# EAGLE design MxxxSMT (EAGLE 6.6.0)

## Sheet 1 of 8
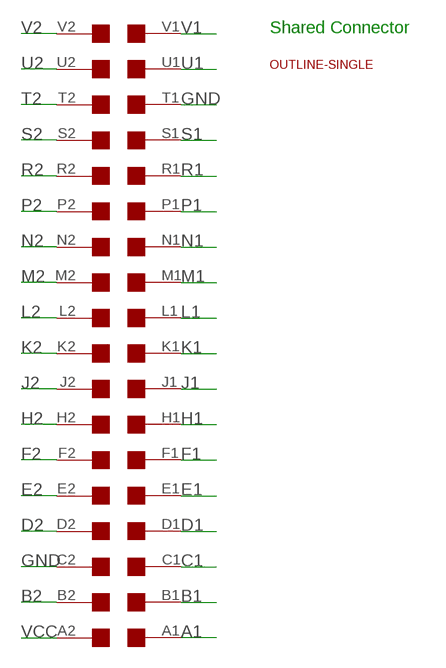
[diagram p0: schematic, sheet 1]

### Parts
U$1  EDGE-2CONNECTOR  [EDGE-CON2]
U$4  OUTLINE-SINGLE  [SINGLE]

### Nets
A1: U$1.A1 ; also sheet 2,3,4,5,6,7,8
B1: U$1.B1 ; also sheet 2,3,4,5,6,7,8
B2: U$1.B2
C1: U$1.C1 ; also sheet 2,3,4,5,6,7,8
D1: U$1.D1 ; also sheet 2,3,4,5,6,7,8
D2: U$1.D2 ; also sheet 2,3,4,5,6,7,8
E1: U$1.E1 ; also sheet 2,3,4,5,7,8
E2: U$1.E2 ; also sheet 2,3,4,5,6,7,8
F1: U$1.F1 ; also sheet 2,3,4,5,6,7,8
F2: U$1.F2 ; also sheet 2,3,4,5,6,7,8
GND [Power]: U$1.C2 U$1.T1 ; also sheet 2,3,4,5,6,7,8
H1: U$1.H1 ; also sheet 2,3,4,5,6,7,8
H2: U$1.H2 ; also sheet 2,3,4,5,6,7,8
J1: U$1.J1 ; also sheet 2,3,4,5,6,7,8
J2: U$1.J2 ; also sheet 2,3,4,5,6,7,8
K1: U$1.K1 ; also sheet 2,3,4,5,6,7,8
K2: U$1.K2 ; also sheet 2,3,4,5,6,7,8
L1: U$1.L1 ; also sheet 2,3,4,5,7,8
L2: U$1.L2 ; also sheet 2,3,4,5,6,7,8
M1: U$1.M1 ; also sheet 2,3,4,5,6,7,8
M2: U$1.M2 ; also sheet 2,3,4,5,6,7,8
N1: U$1.N1 ; also sheet 2,3,4,5,6,7,8
N2: U$1.N2 ; also sheet 2,3,4,5,6,7,8
P1: U$1.P1 ; also sheet 2,3,4,5,6,7,8
P2: U$1.P2 ; also sheet 2,3,4,5,6,7,8
R1: U$1.R1 ; also sheet 2,3,4,5,6,7,8
R2: U$1.R2 ; also sheet 2,3,4,5,6,7,8
S1: U$1.S1 ; also sheet 2,3,4,5,7,8
S2: U$1.S2 ; also sheet 2,3,4,5,6,7,8
T2: U$1.T2 ; also sheet 2,3,4,5,6,7,8
U1: U$1.U1 ; also sheet 2,3,4,7,8
U2: U$1.U2 ; also sheet 2,3,4,5,6,7,8
V1: U$1.V1 ; also sheet 2,3,4,7,8
V2: U$1.V2 ; also sheet 2,3,4,5,6,7,8
VCC [Power]: U$1.A2 ; also sheet 2,3,4,5,6,7,8

### Notes on the sheet
- Shared Connector

## Sheet 2 of 8
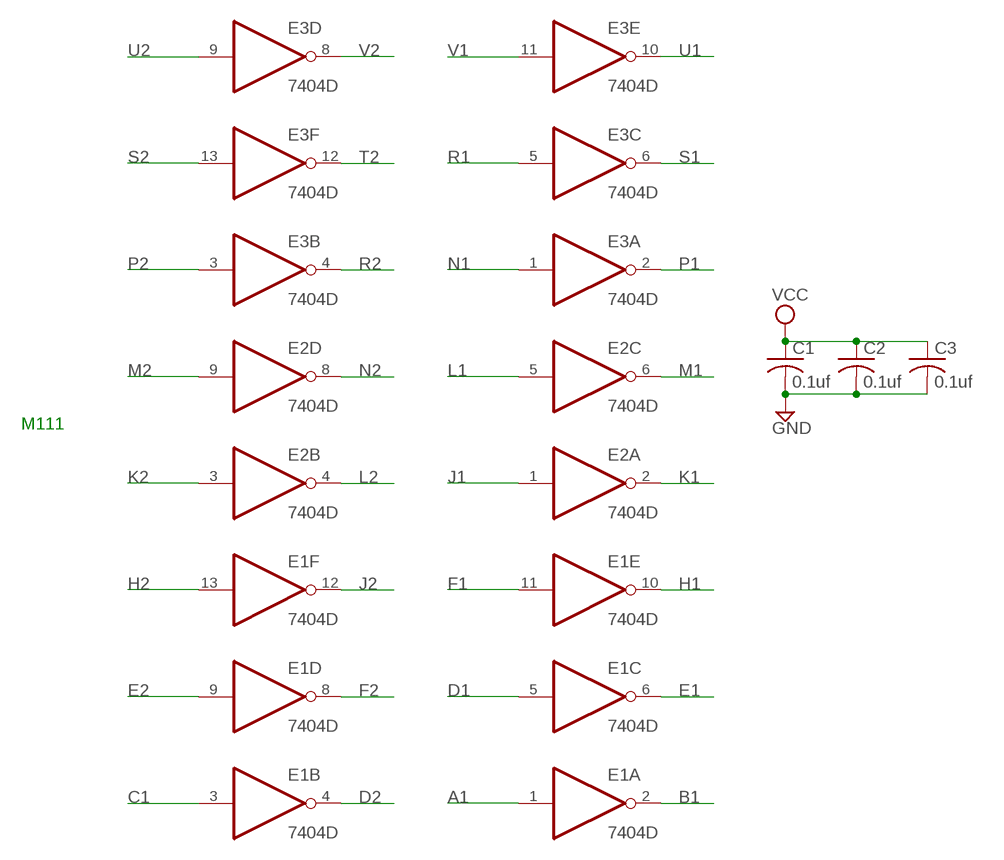
[diagram p1: schematic, sheet 2]

### Parts
C1  0.1uf  C-US050-025X075  [C050-025X075]
C2  0.1uf  C-US050-025X075  [C050-025X075]
C3  0.1uf  C-US050-025X075  [C050-025X075]
E1  7404D  [SO14]
E2  7404D  [SO14]
E3  7404D  [SO14]

### Nets
A1: E1.1(A:I) ; also sheet 1,3,4,5,6,7,8
B1: E1.2(A:O) ; also sheet 1,3,4,5,6,7,8
C1: E1.3(B:I) ; also sheet 1,3,4,5,6,7,8
D1: E1.5(C:I) ; also sheet 1,3,4,5,6,7,8
D2: E1.4(B:O) ; also sheet 1,3,4,5,6,7,8
E1: E1.6(C:O) ; also sheet 1,3,4,5,7,8
E2: E1.9(D:I) ; also sheet 1,3,4,5,6,7,8
F1: E1.11(E:I) ; also sheet 1,3,4,5,6,7,8
F2: E1.8(D:O) ; also sheet 1,3,4,5,6,7,8
GND [Power]: C1.2 C2.2 C3.2 ; also sheet 1,3,4,5,6,7,8
H1: E1.10(E:O) ; also sheet 1,3,4,5,6,7,8
H2: E1.13(F:I) ; also sheet 1,3,4,5,6,7,8
J1: E2.1(A:I) ; also sheet 1,3,4,5,6,7,8
J2: E1.12(F:O) ; also sheet 1,3,4,5,6,7,8
K1: E2.2(A:O) ; also sheet 1,3,4,5,6,7,8
K2: E2.3(B:I) ; also sheet 1,3,4,5,6,7,8
L1: E2.5(C:I) ; also sheet 1,3,4,5,7,8
L2: E2.4(B:O) ; also sheet 1,3,4,5,6,7,8
M1: E2.6(C:O) ; also sheet 1,3,4,5,6,7,8
M2: E2.9(D:I) ; also sheet 1,3,4,5,6,7,8
N1: E3.1(A:I) ; also sheet 1,3,4,5,6,7,8
N2: E2.8(D:O) ; also sheet 1,3,4,5,6,7,8
P1: E3.2(A:O) ; also sheet 1,3,4,5,6,7,8
P2: E3.3(B:I) ; also sheet 1,3,4,5,6,7,8
R1: E3.5(C:I) ; also sheet 1,3,4,5,6,7,8
R2: E3.4(B:O) ; also sheet 1,3,4,5,6,7,8
S1: E3.6(C:O) ; also sheet 1,3,4,5,7,8
S2: E3.13(F:I) ; also sheet 1,3,4,5,6,7,8
T2: E3.12(F:O) ; also sheet 1,3,4,5,6,7,8
U1: E3.10(E:O) ; also sheet 1,3,4,7,8
U2: E3.9(D:I) ; also sheet 1,3,4,5,6,7,8
V1: E3.11(E:I) ; also sheet 1,3,4,7,8
V2: E3.8(D:O) ; also sheet 1,3,4,5,6,7,8
VCC [Power]: C1.1 C2.1 C3.1 ; also sheet 1,3,4,5,6,7,8
Unconnected: E2.10(E:O) E2.11(E:I) E2.12(F:O) E2.13(F:I)

### Notes on the sheet
- M111

## Sheet 3 of 8
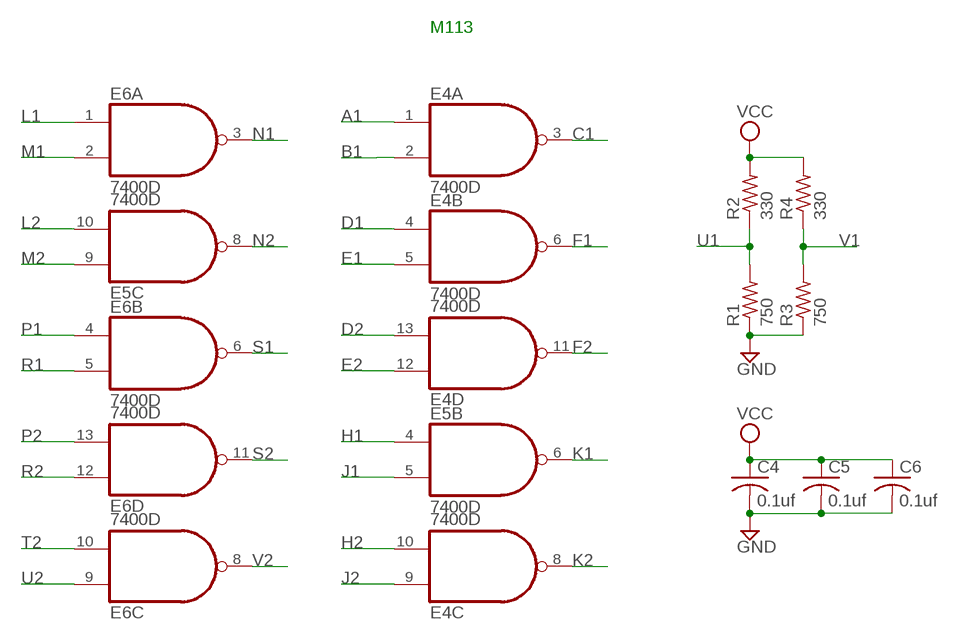
[diagram p2: schematic, sheet 3]

### Parts
C4  0.1uf  C-US050-025X075  [C050-025X075]
C5  0.1uf  C-US050-025X075  [C050-025X075]
C6  0.1uf  C-US050-025X075  [C050-025X075]
E4  7400D  [SO14]
E5  7400D  [SO14]
E6  7400D  [SO14]
R1  750  R-US_0207/10  [0207/10]
R2  330  R-US_0207/10  [0207/10]
R3  750  R-US_0207/10  [0207/10]
R4  330  R-US_0207/10  [0207/10]

### Nets
A1: E4.1(A:I0) ; also sheet 1,2,4,5,6,7,8
B1: E4.2(A:I1) ; also sheet 1,2,4,5,6,7,8
C1: E4.3(A:O) ; also sheet 1,2,4,5,6,7,8
D1: E4.4(B:I0) ; also sheet 1,2,4,5,6,7,8
D2: E4.13(D:I1) ; also sheet 1,2,4,5,6,7,8
E1: E4.5(B:I1) ; also sheet 1,2,4,5,7,8
E2: E4.12(D:I0) ; also sheet 1,2,4,5,6,7,8
F1: E4.6(B:O) ; also sheet 1,2,4,5,6,7,8
F2: E4.11(D:O) ; also sheet 1,2,4,5,6,7,8
GND [Power]: C4.2 C5.2 C6.2 R1.1 R3.1 ; also sheet 1,2,4,5,6,7,8
H1: E5.4(B:I0) ; also sheet 1,2,4,5,6,7,8
H2: E4.10(C:I1) ; also sheet 1,2,4,5,6,7,8
J1: E5.5(B:I1) ; also sheet 1,2,4,5,6,7,8
J2: E4.9(C:I0) ; also sheet 1,2,4,5,6,7,8
K1: E5.6(B:O) ; also sheet 1,2,4,5,6,7,8
K2: E4.8(C:O) ; also sheet 1,2,4,5,6,7,8
L1: E6.1(A:I0) ; also sheet 1,2,4,5,7,8
L2: E5.10(C:I1) ; also sheet 1,2,4,5,6,7,8
M1: E6.2(A:I1) ; also sheet 1,2,4,5,6,7,8
M2: E5.9(C:I0) ; also sheet 1,2,4,5,6,7,8
N1: E6.3(A:O) ; also sheet 1,2,4,5,6,7,8
N2: E5.8(C:O) ; also sheet 1,2,4,5,6,7,8
P1: E6.4(B:I0) ; also sheet 1,2,4,5,6,7,8
P2: E6.13(D:I1) ; also sheet 1,2,4,5,6,7,8
R1: E6.5(B:I1) ; also sheet 1,2,4,5,6,7,8
R2: E6.12(D:I0) ; also sheet 1,2,4,5,6,7,8
S1: E6.6(B:O) ; also sheet 1,2,4,5,7,8
S2: E6.11(D:O) ; also sheet 1,2,4,5,6,7,8
T2: E6.10(C:I1) ; also sheet 1,2,4,5,6,7,8
U1: R1.2 R2.1 ; also sheet 1,2,4,7,8
U2: E6.9(C:I0) ; also sheet 1,2,4,5,6,7,8
V1: R3.2 R4.1 ; also sheet 1,2,4,7,8
V2: E6.8(C:O) ; also sheet 1,2,4,5,6,7,8
VCC [Power]: C4.1 C5.1 C6.1 R2.2 R4.2 ; also sheet 1,2,4,5,6,7,8
Unconnected: E5.1(A:I0) E5.2(A:I1) E5.3(A:O) E5.11(D:O) E5.12(D:I0) E5.13(D:I1)

### Notes on the sheet
- M113

## Sheet 4 of 8
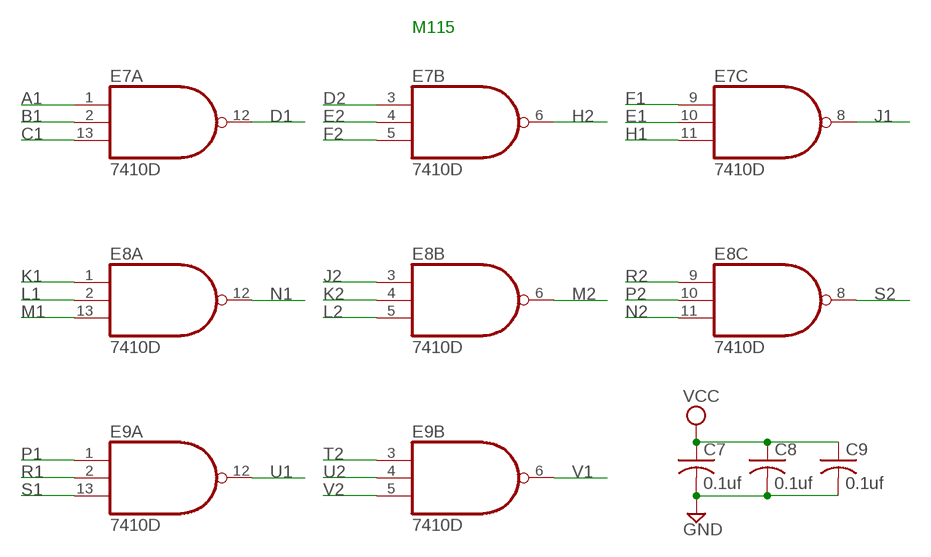
[diagram p3: schematic, sheet 4]

### Parts
C7  0.1uf  C-US050-025X075  [C050-025X075]
C8  0.1uf  C-US050-025X075  [C050-025X075]
C9  0.1uf  C-US050-025X075  [C050-025X075]
E7  7410D  [SO14]
E8  7410D  [SO14]
E9  7410D  [SO14]

### Nets
A1: E7.1(A:I0) ; also sheet 1,2,3,5,6,7,8
B1: E7.2(A:I1) ; also sheet 1,2,3,5,6,7,8
C1: E7.13(A:I2) ; also sheet 1,2,3,5,6,7,8
D1: E7.12(A:O) ; also sheet 1,2,3,5,6,7,8
D2: E7.3(B:I0) ; also sheet 1,2,3,5,6,7,8
E1: E7.10(C:I1) ; also sheet 1,2,3,5,7,8
E2: E7.4(B:I1) ; also sheet 1,2,3,5,6,7,8
F1: E7.9(C:I0) ; also sheet 1,2,3,5,6,7,8
F2: E7.5(B:I2) ; also sheet 1,2,3,5,6,7,8
GND [Power]: C7.2 C8.2 C9.2 ; also sheet 1,2,3,5,6,7,8
H1: E7.11(C:I2) ; also sheet 1,2,3,5,6,7,8
H2: E7.6(B:O) ; also sheet 1,2,3,5,6,7,8
J1: E7.8(C:O) ; also sheet 1,2,3,5,6,7,8
J2: E8.3(B:I0) ; also sheet 1,2,3,5,6,7,8
K1: E8.1(A:I0) ; also sheet 1,2,3,5,6,7,8
K2: E8.4(B:I1) ; also sheet 1,2,3,5,6,7,8
L1: E8.2(A:I1) ; also sheet 1,2,3,5,7,8
L2: E8.5(B:I2) ; also sheet 1,2,3,5,6,7,8
M1: E8.13(A:I2) ; also sheet 1,2,3,5,6,7,8
M2: E8.6(B:O) ; also sheet 1,2,3,5,6,7,8
N1: E8.12(A:O) ; also sheet 1,2,3,5,6,7,8
N2: E8.11(C:I2) ; also sheet 1,2,3,5,6,7,8
P1: E9.1(A:I0) ; also sheet 1,2,3,5,6,7,8
P2: E8.10(C:I1) ; also sheet 1,2,3,5,6,7,8
R1: E9.2(A:I1) ; also sheet 1,2,3,5,6,7,8
R2: E8.9(C:I0) ; also sheet 1,2,3,5,6,7,8
S1: E9.13(A:I2) ; also sheet 1,2,3,5,7,8
S2: E8.8(C:O) ; also sheet 1,2,3,5,6,7,8
T2: E9.3(B:I0) ; also sheet 1,2,3,5,6,7,8
U1: E9.12(A:O) ; also sheet 1,2,3,7,8
U2: E9.4(B:I1) ; also sheet 1,2,3,5,6,7,8
V1: E9.6(B:O) ; also sheet 1,2,3,7,8
V2: E9.5(B:I2) ; also sheet 1,2,3,5,6,7,8
VCC [Power]: C7.1 C8.1 C9.1 ; also sheet 1,2,3,5,6,7,8
Unconnected: E9.8(C:O) E9.9(C:I0) E9.10(C:I1) E9.11(C:I2)

### Notes on the sheet
- M115

## Sheet 5 of 8
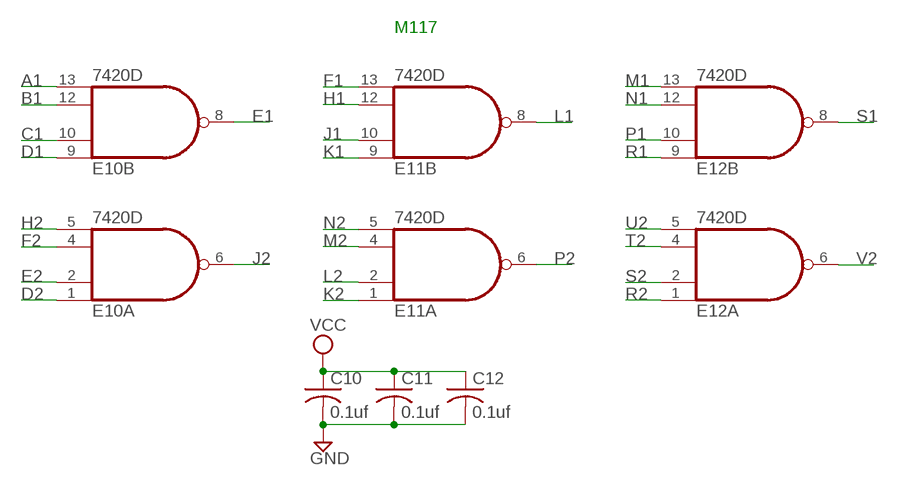
[diagram p4: schematic, sheet 5]

### Parts
C10  0.1uf  C-US050-025X075  [C050-025X075]
C11  0.1uf  C-US050-025X075  [C050-025X075]
C12  0.1uf  C-US050-025X075  [C050-025X075]
E10  7420D  74S20D  [SO14]
E11  7420D  74S20D  [SO14]
E12  7420D  74S20D  [SO14]

### Nets
A1: E10.13(B:I3) ; also sheet 1,2,3,4,6,7,8
B1: E10.12(B:I2) ; also sheet 1,2,3,4,6,7,8
C1: E10.10(B:I1) ; also sheet 1,2,3,4,6,7,8
D1: E10.9(B:I0) ; also sheet 1,2,3,4,6,7,8
D2: E10.1(A:I0) ; also sheet 1,2,3,4,6,7,8
E1: E10.8(B:O) ; also sheet 1,2,3,4,7,8
E2: E10.2(A:I1) ; also sheet 1,2,3,4,6,7,8
F1: E11.13(B:I3) ; also sheet 1,2,3,4,6,7,8
F2: E10.4(A:I2) ; also sheet 1,2,3,4,6,7,8
GND [Power]: C10.2 C11.2 C12.2 ; also sheet 1,2,3,4,6,7,8
H1: E11.12(B:I2) ; also sheet 1,2,3,4,6,7,8
H2: E10.5(A:I3) ; also sheet 1,2,3,4,6,7,8
J1: E11.10(B:I1) ; also sheet 1,2,3,4,6,7,8
J2: E10.6(A:O) ; also sheet 1,2,3,4,6,7,8
K1: E11.9(B:I0) ; also sheet 1,2,3,4,6,7,8
K2: E11.1(A:I0) ; also sheet 1,2,3,4,6,7,8
L1: E11.8(B:O) ; also sheet 1,2,3,4,7,8
L2: E11.2(A:I1) ; also sheet 1,2,3,4,6,7,8
M1: E12.13(B:I3) ; also sheet 1,2,3,4,6,7,8
M2: E11.4(A:I2) ; also sheet 1,2,3,4,6,7,8
N1: E12.12(B:I2) ; also sheet 1,2,3,4,6,7,8
N2: E11.5(A:I3) ; also sheet 1,2,3,4,6,7,8
P1: E12.10(B:I1) ; also sheet 1,2,3,4,6,7,8
P2: E11.6(A:O) ; also sheet 1,2,3,4,6,7,8
R1: E12.9(B:I0) ; also sheet 1,2,3,4,6,7,8
R2: E12.1(A:I0) ; also sheet 1,2,3,4,6,7,8
S1: E12.8(B:O) ; also sheet 1,2,3,4,7,8
S2: E12.2(A:I1) ; also sheet 1,2,3,4,6,7,8
T2: E12.4(A:I2) ; also sheet 1,2,3,4,6,7,8
U2: E12.5(A:I3) ; also sheet 1,2,3,4,6,7,8
V2: E12.6(A:O) ; also sheet 1,2,3,4,6,7,8
VCC [Power]: C10.1 C11.1 C12.1 ; also sheet 1,2,3,4,6,7,8

### Notes on the sheet
- M117

## Sheet 6 of 8
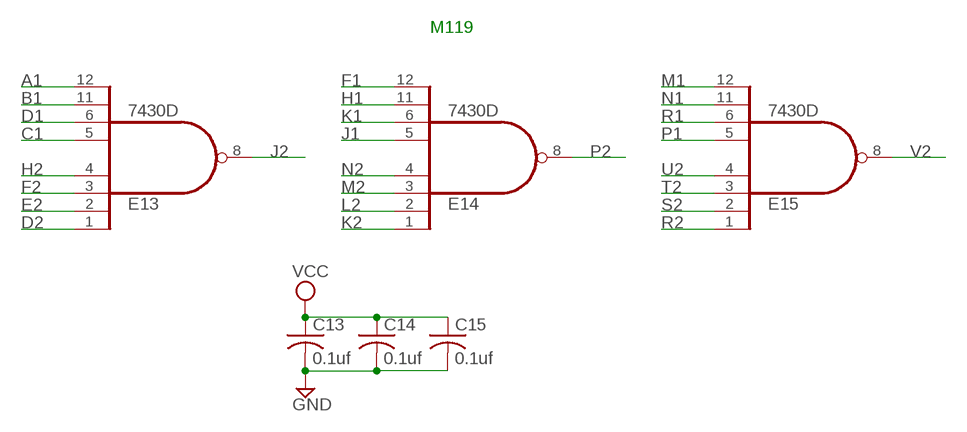
[diagram p5: schematic, sheet 6]

### Parts
C13  0.1uf  C-US050-025X075  [C050-025X075]
C14  0.1uf  C-US050-025X075  [C050-025X075]
C15  0.1uf  C-US050-025X075  [C050-025X075]
E13  7430D  [SO14]
E14  7430D  [SO14]
E15  7430D  [SO14]

### Nets
A1: E13.12(I7) ; also sheet 1,2,3,4,5,7,8
B1: E13.11(I6) ; also sheet 1,2,3,4,5,7,8
C1: E13.5(I4) ; also sheet 1,2,3,4,5,7,8
D1: E13.6(I5) ; also sheet 1,2,3,4,5,7,8
D2: E13.1(I0) ; also sheet 1,2,3,4,5,7,8
E2: E13.2(I1) ; also sheet 1,2,3,4,5,7,8
F1: E14.12(I7) ; also sheet 1,2,3,4,5,7,8
F2: E13.3(I2) ; also sheet 1,2,3,4,5,7,8
GND [Power]: C13.2 C14.2 C15.2 ; also sheet 1,2,3,4,5,7,8
H1: E14.11(I6) ; also sheet 1,2,3,4,5,7,8
H2: E13.4(I3) ; also sheet 1,2,3,4,5,7,8
J1: E14.5(I4) ; also sheet 1,2,3,4,5,7,8
J2: E13.8(O) ; also sheet 1,2,3,4,5,7,8
K1: E14.6(I5) ; also sheet 1,2,3,4,5,7,8
K2: E14.1(I0) ; also sheet 1,2,3,4,5,7,8
L2: E14.2(I1) ; also sheet 1,2,3,4,5,7,8
M1: E15.12(I7) ; also sheet 1,2,3,4,5,7,8
M2: E14.3(I2) ; also sheet 1,2,3,4,5,7,8
N1: E15.11(I6) ; also sheet 1,2,3,4,5,7,8
N2: E14.4(I3) ; also sheet 1,2,3,4,5,7,8
P1: E15.5(I4) ; also sheet 1,2,3,4,5,7,8
P2: E14.8(O) ; also sheet 1,2,3,4,5,7,8
R1: E15.6(I5) ; also sheet 1,2,3,4,5,7,8
R2: E15.1(I0) ; also sheet 1,2,3,4,5,7,8
S2: E15.2(I1) ; also sheet 1,2,3,4,5,7,8
T2: E15.3(I2) ; also sheet 1,2,3,4,5,7,8
U2: E15.4(I3) ; also sheet 1,2,3,4,5,7,8
V2: E15.8(O) ; also sheet 1,2,3,4,5,7,8
VCC [Power]: C13.1 C14.1 C15.1 ; also sheet 1,2,3,4,5,7,8

### Notes on the sheet
- M119

## Sheet 7 of 8
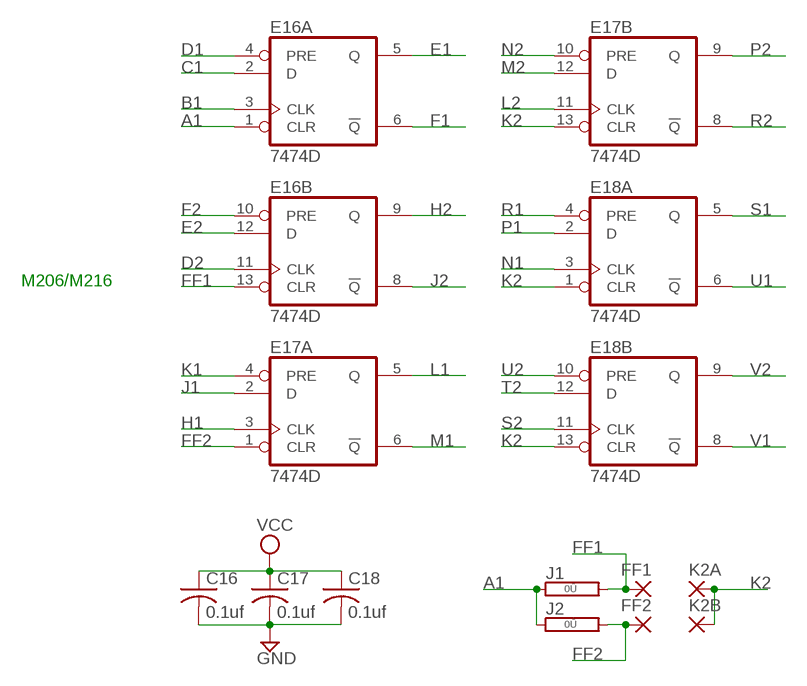
[diagram p6: schematic, sheet 7]

### Parts
C16  0.1uf  C-US050-025X075  [C050-025X075]
C17  0.1uf  C-US050-025X075  [C050-025X075]
C18  0.1uf  C-US050-025X075  [C050-025X075]
E16  7474D  74S74D  [SO14]
E17  7474D  74S74D  [SO14]
E18  7474D  74S74D  [SO14]
FF1  1,6/0,8  [1,6/0,8]
FF2  1,6/0,8  [1,6/0,8]
J1  0R  [0R/10]
J2  0R  [0R/10]
K2A  1,6/0,8  [1,6/0,8]
K2B  1,6/0,8  [1,6/0,8]

### Nets
A1: E16.1(A:CLR) J1.1 J2.1 ; also sheet 1,2,3,4,5,6,8
B1: E16.3(A:CLK) ; also sheet 1,2,3,4,5,6,8
C1: E16.2(A:D) ; also sheet 1,2,3,4,5,6,8
D1: E16.4(A:PRE) ; also sheet 1,2,3,4,5,6,8
D2: E16.11(B:CLK) ; also sheet 1,2,3,4,5,6,8
E1: E16.5(A:Q) ; also sheet 1,2,3,4,5,8
E2: E16.12(B:D) ; also sheet 1,2,3,4,5,6,8
F1: E16.6(A:!Q) ; also sheet 1,2,3,4,5,6,8
F2: E16.10(B:PRE) ; also sheet 1,2,3,4,5,6,8
FF1: E16.13(B:CLR) FF1.1(P) J1.2 ; also sheet 8
FF2: E17.1(A:CLR) FF2.1(P) J2.2 ; also sheet 8
GND [Power]: C16.2 C17.2 C18.2 ; also sheet 1,2,3,4,5,6,8
H1: E17.3(A:CLK) ; also sheet 1,2,3,4,5,6,8
H2: E16.9(B:Q) ; also sheet 1,2,3,4,5,6,8
J1: E17.2(A:D) ; also sheet 1,2,3,4,5,6,8
J2: E16.8(B:!Q) ; also sheet 1,2,3,4,5,6,8
K1: E17.4(A:PRE) ; also sheet 1,2,3,4,5,6,8
K2: E17.13(B:CLR) E18.1(A:CLR) E18.13(B:CLR) K2A.1(P) K2B.1(P) ; also sheet 1,2,3,4,5,6,8
L1: E17.5(A:Q) ; also sheet 1,2,3,4,5,8
L2: E17.11(B:CLK) ; also sheet 1,2,3,4,5,6,8
M1: E17.6(A:!Q) ; also sheet 1,2,3,4,5,6,8
M2: E17.12(B:D) ; also sheet 1,2,3,4,5,6,8
N1: E18.3(A:CLK) ; also sheet 1,2,3,4,5,6,8
N2: E17.10(B:PRE) ; also sheet 1,2,3,4,5,6,8
P1: E18.2(A:D) ; also sheet 1,2,3,4,5,6,8
P2: E17.9(B:Q) ; also sheet 1,2,3,4,5,6,8
R1: E18.4(A:PRE) ; also sheet 1,2,3,4,5,6,8
R2: E17.8(B:!Q) ; also sheet 1,2,3,4,5,6,8
S1: E18.5(A:Q) ; also sheet 1,2,3,4,5,8
S2: E18.11(B:CLK) ; also sheet 1,2,3,4,5,6,8
T2: E18.12(B:D) ; also sheet 1,2,3,4,5,6,8
U1: E18.6(A:!Q) ; also sheet 1,2,3,4,8
U2: E18.10(B:PRE) ; also sheet 1,2,3,4,5,6,8
V1: E18.8(B:!Q) ; also sheet 1,2,3,4,8
V2: E18.9(B:Q) ; also sheet 1,2,3,4,5,6,8
VCC [Power]: C16.1 C17.1 C18.1 ; also sheet 1,2,3,4,5,6,8

### Notes on the sheet
- M206/M216

## Sheet 8 of 8
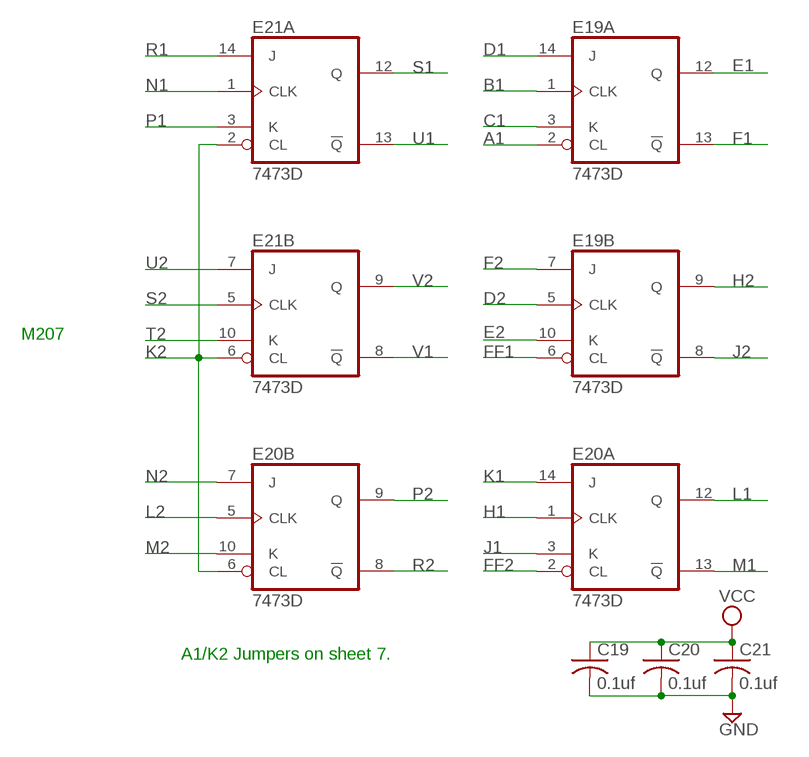
[diagram p7: schematic, sheet 8]

### Parts
C19  0.1uf  C-US050-025X075  [C050-025X075]
C20  0.1uf  C-US050-025X075  [C050-025X075]
C21  0.1uf  C-US050-025X075  [C050-025X075]
E19  7473D  74LS73D  [SO14]
E20  7473D  74LS73D  [SO14]
E21  7473D  74LS73D  [SO14]

### Nets
A1: E19.2(A:CL) ; also sheet 1,2,3,4,5,6,7
B1: E19.1(A:CLK) ; also sheet 1,2,3,4,5,6,7
C1: E19.3(A:K) ; also sheet 1,2,3,4,5,6,7
D1: E19.14(A:J) ; also sheet 1,2,3,4,5,6,7
D2: E19.5(B:CLK) ; also sheet 1,2,3,4,5,6,7
E1: E19.12(A:Q) ; also sheet 1,2,3,4,5,7
E2: E19.10(B:K) ; also sheet 1,2,3,4,5,6,7
F1: E19.13(A:!Q) ; also sheet 1,2,3,4,5,6,7
F2: E19.7(B:J) ; also sheet 1,2,3,4,5,6,7
FF1: E19.6(B:CL) ; also sheet 7
FF2: E20.2(A:CL) ; also sheet 7
GND [Power]: C19.2 C20.2 C21.2 ; also sheet 1,2,3,4,5,6,7
H1: E20.1(A:CLK) ; also sheet 1,2,3,4,5,6,7
H2: E19.9(B:Q) ; also sheet 1,2,3,4,5,6,7
J1: E20.3(A:K) ; also sheet 1,2,3,4,5,6,7
J2: E19.8(B:!Q) ; also sheet 1,2,3,4,5,6,7
K1: E20.14(A:J) ; also sheet 1,2,3,4,5,6,7
K2: E20.6(B:CL) E21.2(A:CL) E21.6(B:CL) ; also sheet 1,2,3,4,5,6,7
L1: E20.12(A:Q) ; also sheet 1,2,3,4,5,7
L2: E20.5(B:CLK) ; also sheet 1,2,3,4,5,6,7
M1: E20.13(A:!Q) ; also sheet 1,2,3,4,5,6,7
M2: E20.10(B:K) ; also sheet 1,2,3,4,5,6,7
N1: E21.1(A:CLK) ; also sheet 1,2,3,4,5,6,7
N2: E20.7(B:J) ; also sheet 1,2,3,4,5,6,7
P1: E21.3(A:K) ; also sheet 1,2,3,4,5,6,7
P2: E20.9(B:Q) ; also sheet 1,2,3,4,5,6,7
R1: E21.14(A:J) ; also sheet 1,2,3,4,5,6,7
R2: E20.8(B:!Q) ; also sheet 1,2,3,4,5,6,7
S1: E21.12(A:Q) ; also sheet 1,2,3,4,5,7
S2: E21.5(B:CLK) ; also sheet 1,2,3,4,5,6,7
T2: E21.10(B:K) ; also sheet 1,2,3,4,5,6,7
U1: E21.13(A:!Q) ; also sheet 1,2,3,4,7
U2: E21.7(B:J) ; also sheet 1,2,3,4,5,6,7
V1: E21.8(B:!Q) ; also sheet 1,2,3,4,7
V2: E21.9(B:Q) ; also sheet 1,2,3,4,5,6,7
VCC [Power]: C19.1 C20.1 C21.1 ; also sheet 1,2,3,4,5,6,7

### Notes on the sheet
- M207
- A1/K2 Jumpers on sheet 7.

## Power pins joined to a net without a drawn wire
GND: E1.7(P:GND) E2.7(P:GND) E3.7(P:GND) E4.7(P:GND) E5.7(P:GND) E6.7(P:GND) E7.7(P:GND) E8.7(P:GND) E9.7(P:GND) E10.7(P:GND) E11.7(P:GND) E12.7(P:GND) E13.7(GND) E14.7(GND) E15.7(GND) E16.7(P:GND) E17.7(P:GND) E18.7(P:GND) E19.11(P:GND) E20.11(P:GND) E21.11(P:GND)
VCC: E1.14(P:VCC) E2.14(P:VCC) E3.14(P:VCC) E4.14(P:VCC) E5.14(P:VCC) E6.14(P:VCC) E7.14(P:VCC) E8.14(P:VCC) E9.14(P:VCC) E10.14(P:VCC) E11.14(P:VCC) E12.14(P:VCC) E13.14(VCC) E14.14(VCC) E15.14(VCC) E16.14(P:VCC) E17.14(P:VCC) E18.14(P:VCC) E19.4(P:VCC) E20.4(P:VCC) E21.4(P:VCC)

## Library data of the parts
C1-C21 = rcl:C-US: CAPACITOR, American symbol
E1-E3 = 74xx-us:74*04: Hex INVERTER
E4-E6 = 74xx-us:74*00: Quad 2-input NAND gate
E7-E9 = 74xx-us:74*10: Triple 3-input NAND gate
E10-E12 = 74xx-us:74*20: Dual 4-input NAND gate
E13-E15 = 74xx-us:74*30: 8-input NAND gate
E16-E18 = 74xx-us:74*74: Dual D type positive edge triggered FLIP FLOP, preset and clear
E19-E21 = 74xx-us:74*73: Dual J-K FLIP FLOP, clear
FF1 FF2 K2A K2B = wirepad:1,6/0,8: THROUGH-HOLE PAD
J1 J2 = jumper:0R: Bridge 0R 10mm
R1-R4 = rcl:R-US_: RESISTOR, American symbol
U$1 = dec-con:EDGE-2: Double-Sided DEC edge connector.
U$4 = dec-con:OUTLINE-*: Board outlines for DEC boards.

## Net classes
1 Power: width 0.381 mm

## Board
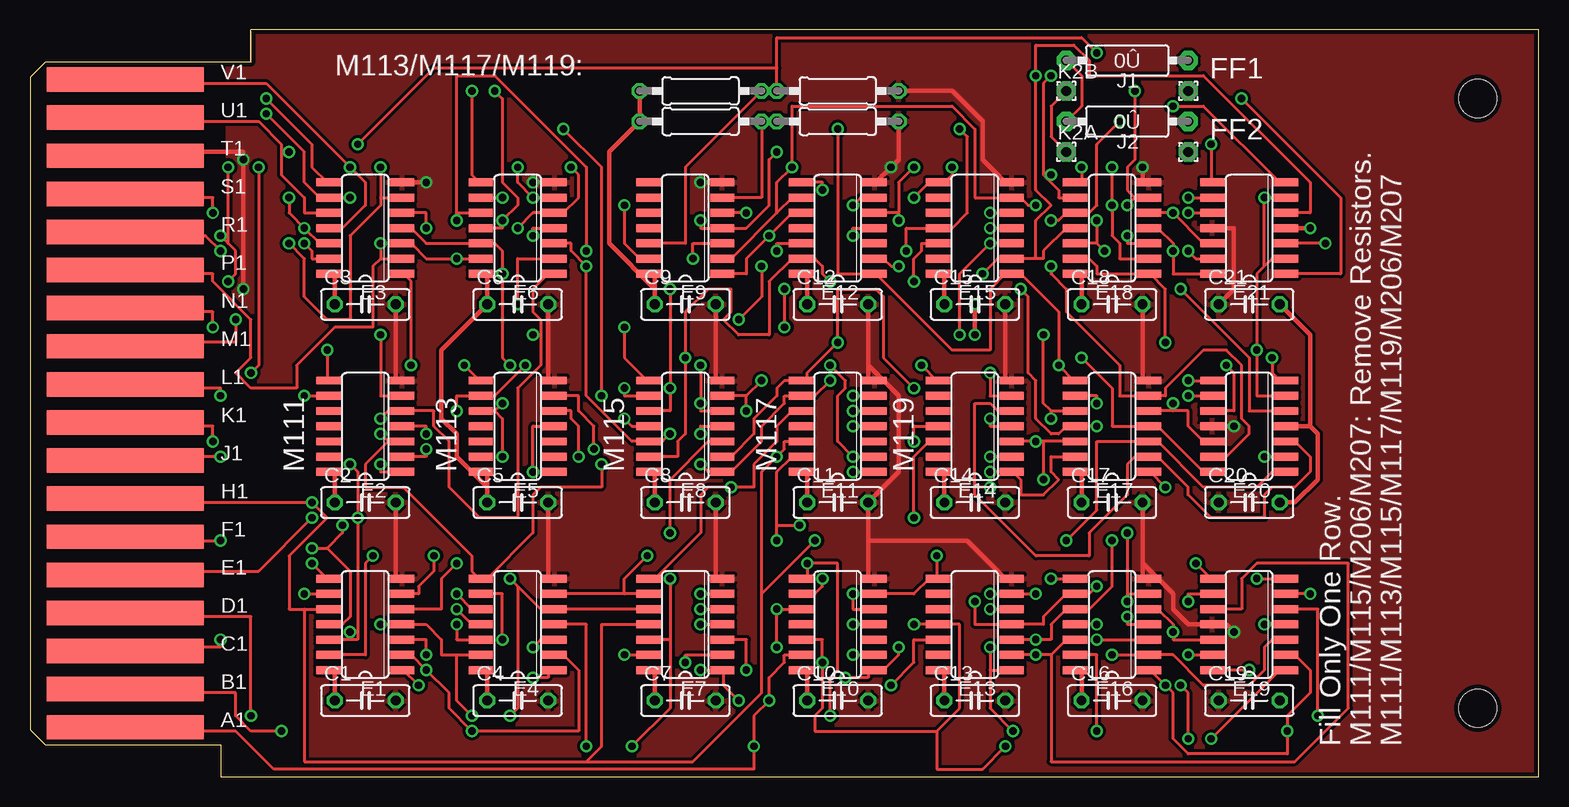
[diagram p8: board, top side]
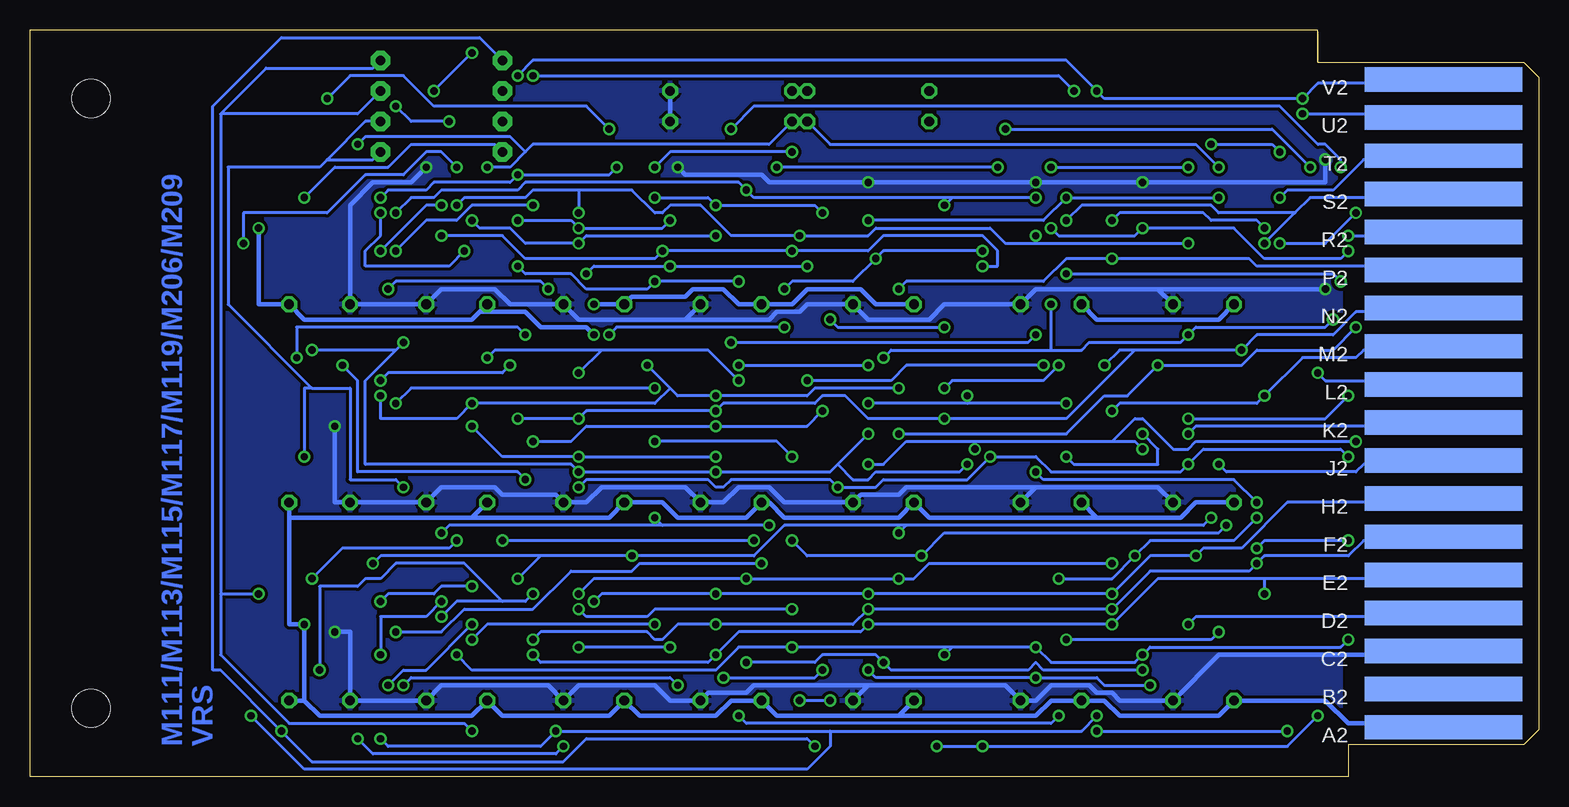
[diagram p9: board, bottom side, seen from below]

Size 125.73 x 62.23 mm. Coordinates in mm from the lower left corner, seen from the top.
Copper layers (1*16): Top 0.035mm / dielectric 1.5mm / Bottom 0.035mm
Design rules "10mils": minimum track width 10mil, minimum drill 24mil, track to track 10mil, track to pad 10mil, pad to pad 10mil, via to via 10mil, smd to smd 0mil, copper to edge 15mil, drill to drill 10mil, minimum pad ring 10mil, minimum via ring 8mil, stop-mask expansion 0mil, vias tented up to drill 0mil, thermal gap 10mil

### Footprints (pad centres in the part's own frame; a part is rotated, then mirrored left to right if it is on the bottom)
C050-025X075 = drill 0.813 octagon: 1 -2.54,0; 2 2.54,0
SO14 = smd 0.66 x 2.032: 1 -3.81,-3.073; 2 -2.54,-3.073; 3 -1.27,-3.073; 4 0,-3.073; 5 1.27,-3.073; 6 2.54,-3.073; 7 3.81,-3.073; 8 3.81,3.073; 9 2.54,3.073; 10 1.27,3.073; 11 0,3.073; 12 -1.27,3.073; 13 -2.54,3.073; 14 -3.81,3.073
1,6/0,8 = drill 0.813 pad 1.6 octagon: 1 0,0
0R/10 = drill 0.813 pad 1.6 octagon: 1 -5.08,0; 2 5.08,0
0207/10 = drill 0.813 octagon: 1 -5.08,0; 2 5.08,0
EDGE-CON2 = smd 13.106 x 2.032: A1 7.938,4.128; B1 7.938,7.303; C1 7.938,10.477; D1 7.938,13.652; E1 7.938,16.828; F1 7.938,20.003; H1 7.938,23.177; J1 7.938,26.352; K1 7.938,29.527; L1 7.938,32.703; M1 7.938,35.877; N1 7.938,39.053; P1 7.938,42.227; R1 7.938,45.403; S1 7.938,48.578; T1 7.938,51.752; U1 7.938,54.928; V1 7.938,58.102 | smd 13.106 x 2.032 bottom: A2 7.938,4.128; B2 7.938,7.303; C2 7.938,10.477; D2 7.938,13.652; E2 7.938,16.828; F2 7.938,20.003; H2 7.938,23.177; J2 7.938,26.352; K2 7.938,29.527; L2 7.938,32.703; M2 7.938,35.877; N2 7.938,39.053; P2 7.938,42.227; R2 7.938,45.403; S2 7.938,48.578; T2 7.938,51.752; U2 7.938,54.928; V2 7.938,58.102
SINGLE = hole 3.175: 120.65,56.515; 120.65,5.715

### Placement (x,y rotation side)
C1  27.94,6.35 0 top
C2  27.94,22.86 0 top
C3  27.94,39.37 0 top
C4  40.64,6.35 0 top
C5  40.64,22.86 0 top
C6  40.64,39.37 0 top
C7  54.61,6.35 0 top
C8  54.61,22.86 0 top
C9  54.61,39.37 0 top
C10  67.31,6.35 0 top
C11  67.31,22.86 0 top
C12  67.31,39.37 0 top
C13  78.74,6.35 0 top
C14  78.74,22.86 0 top
C15  78.74,39.37 0 top
C16  90.17,6.35 0 top
C17  90.17,22.86 0 top
C18  90.17,39.37 0 top
C19  101.6,6.35 180 top
C20  101.6,22.86 180 top
C21  101.6,39.37 180 top
E1  27.94,12.7 90 top
E2  27.94,29.21 90 top
E3  27.94,45.72 90 top
E4  40.64,12.7 90 top
E5  40.64,29.21 90 top
E6  40.64,45.72 90 top
E7  54.61,12.7 90 top
E8  54.61,29.21 90 top
E9  54.61,45.72 90 top
E10  67.31,12.7 90 top
E11  67.31,29.21 90 top
E12  67.31,45.72 90 top
E13  78.74,12.7 90 top
E14  78.74,29.21 90 top
E15  78.74,45.72 90 top
E16  90.17,12.7 90 top
E17  90.17,29.21 90 top
E18  90.17,45.72 90 top
E19  101.6,12.7 90 top
E20  101.6,29.21 90 top
E21  101.6,45.72 90 top
FF1  96.52,57.15 0 top
FF2  96.52,52.07 0 top
J1  91.44,59.69 0 top
J2  91.44,54.61 0 top
K2A  86.36,52.07 0 top
K2B  86.36,57.15 0 top
R1  67.31,57.15 180 top
R2  55.88,57.15 180 top
R3  67.31,54.61 180 top
R4  55.88,54.61 180 top
U$1  0,0 0 top
U$4  0,0 0 top

### Tracks (layer width: path | path; a pad name or v marks a point on that pad's centre or on a via)
A1  (via drill 0.61)
  Top 0.254: v32.39,7.62 31.12,8.89 E1.1 | v41.91,8.26 43.18,8.26 43.18,8.89 E4.1 | v55.88,8.89 E7.1 57.79,8.89 57.79,7.62 v59.06,6.35 | E10.13 62.87,10.16 62.87,9.53 61.6,8.26 v61.6,6.35 60.33,5.08 v60.33,2.54 60.33,0.64 20.32,0.64 17.15,3.81 8.26,3.81 U$1.A1 | J2.1 87.63,55.88 87.63,58.42 J1.1 | E19.2 105.41,10.16 106.68,8.89 106.68,6.99 104.78,5.08 v104.78,3.81 104.78,1.91 96.52,1.91 95.25,3.17 95.25,6.99 v94.62,7.62 93.35,8.89 E16.1 | E13.12 73.66,11.43 73.66,9.53 v71.76,7.62
  Bottom 0.254: v32.39,7.62 36.2,7.62 36.83,8.26 v41.91,8.26 55.25,8.26 v55.88,8.89 | v59.06,6.35 v61.6,6.35 | v71.76,7.62 72.39,8.26 93.98,8.26 v94.62,7.62 | J1.1 88.27,61.59 104.78,61.59 110.49,55.88 110.49,8.89 109.86,8.89 v104.78,3.81 102.24,1.27 81.28,1.27 79.38,3.17 60.96,3.17 v60.33,2.54
B1  (via drill 0.61)
  Top 0.254: E1.2 31.75,10.16 v33.02,8.89 34.93,6.99 34.93,5.71 v36.83,3.81 45.72,3.81 45.72,8.89 44.45,10.16 E4.2 | E7.2 54.61,10.16 v54.61,9.53 | E10.12 66.04,11.43 v66.04,9.53 66.04,5.71 65.41,5.08 65.41,3.81 75.57,3.81 | 75.57,3.81 77.47,5.71 77.47,12.7 E13.11 v73.66,12.7 | v88.9,11.43 E16.3 | v98.43,3.17 104.14,8.89 E19.1 | v81.28,2.54 79.38,0.64 75.57,0.64 75.57,3.81 | v20.96,3.81 18.42,3.81 17.15,5.08 17.15,6.99 8.26,6.99 U$1.B1
  Bottom 0.254: v33.02,8.89 41.28,8.89 41.91,9.53 42.55,8.89 53.98,8.89 v54.61,9.53 55.25,10.16 59.69,10.16 60.33,9.53 v66.04,9.53 | v88.9,11.43 87.63,12.7 v73.66,12.7 | v98.43,3.17 97.16,1.91 81.92,1.91 v81.28,2.54 | v36.83,3.81 v20.96,3.81
C1  (via drill 0.61)
  Top 0.254: E19.3 103.51,11.43 102.87,10.79 102.87,8.89 101.6,7.62 97.79,7.62 95.25,10.16 E16.2 v90.17,10.16 | v49.53,10.16 E7.13 | v41.91,10.79 42.55,11.43 E4.3 | E1.3 33.02,11.43 v33.02,10.16 | E10.10 v62.23,13.97 v62.23,10.79 | v80.01,13.97 E13.5 | v15.88,11.43 15.88,10.79 8.26,10.79 U$1.C1
  Bottom 0.254: 48.9,10.79 v49.53,10.16 | 48.9,10.79 v41.91,10.79 40.64,9.53 33.66,9.53 v33.02,10.16 32.39,10.79 16.51,10.79 v15.88,11.43 | 48.9,10.79 v62.23,10.79 66.68,10.79 68.58,8.89 88.9,8.89 v90.17,10.16 | v80.01,13.97 79.38,13.34 74.3,13.34 73.66,13.97 v62.23,13.97
D1  (via drill 0.61)
  Top 0.254: 53.34,11.43 E7.12 | v53.34,16.51 53.34,11.43 | v66.04,16.51 66.04,15.88 65.41,15.24 E10.9 | E1.5 34.29,13.97 34.29,16.51 v35.56,17.78 | E4.4 46.36,12.7 v46.36,2.54 | v50.17,2.54 53.34,5.71 53.34,11.43 | v80.01,15.24 E13.6 v83.82,15.24 | E16.4 91.44,12.7 v91.44,13.34 | v101.6,8.89 E19.14 | v18.42,5.08 18.42,13.34 8.26,13.34 U$1.D1
  Bottom 0.254: v35.56,17.78 50.8,17.78 52.07,16.51 v53.34,16.51 v66.04,16.51 78.74,16.51 v80.01,15.24 | v50.17,2.54 v46.36,2.54 20.96,2.54 v18.42,5.08 | v91.44,13.34 90.17,14.61 86.36,14.61 | 86.36,14.61 84.46,14.61 v83.82,15.24 | v101.6,8.89 101.6,15.88 98.43,15.88 97.79,16.51 96.52,16.51 95.25,17.78 89.54,17.78 86.36,14.61
D2  (via drill 0.61)
  Top 0.254: 35.56,10.16 34.29,10.16 34.29,11.43 33.02,12.7 E1.4 v29.21,12.7 | 35.56,10.16 E4.13 | E7.3 59.69,11.43 v59.69,8.89 | v67.95,8.26 69.85,8.26 69.85,8.89 E10.1 71.12,8.89 72.39,10.16 v72.39,10.79 | 80.01,8.89 E13.1 | v80.01,10.79 80.01,8.89 | v88.9,12.7 E16.11 | v95.89,7.62 96.52,6.99 v96.52,3.17 | v81.92,3.81 80.01,5.71 80.01,8.89 | E19.5 107.32,13.97 v107.32,5.08 | 35.56,10.16 35.56,6.35 v36.83,5.08
  Bottom 0.254: v29.21,12.7 28.58,13.34 8.26,13.34 U$1.D2 | v59.69,8.89 60.33,8.26 v67.95,8.26 | v72.39,10.79 v80.01,10.79 | v88.9,12.7 92.71,8.89 94.62,8.89 v95.89,7.62 | v96.52,3.17 95.89,2.54 83.19,2.54 v81.92,3.81 59.06,3.81 | v107.32,5.08 102.87,0.64 60.96,0.64 59.06,2.54 59.06,3.81 | v36.83,5.08 38.1,3.81 59.06,3.81
E1  (via drill 0.61)
  Top 0.254: E19.12 95.25,11.43 v95.25,12.06 95.25,12.7 93.98,13.97 E16.5 | E10.8 64.77,16.51 v64.77,17.78 67.31,17.78 67.31,8.89 66.68,8.26 v66.68,5.08 | E7.10 E4.5 42.55,13.97 40.64,15.88 | E1.6 32.39,15.24 32.39,15.88 33.66,17.14 v33.66,18.41 | 40.64,15.88 v40.01,16.51 | v23.5,21.59 19.05,17.14 8.26,17.14 U$1.E1 | v40.01,5.08 40.64,5.71 40.64,15.88
  Bottom 0.254: v64.77,17.78 74.93,17.78 75.57,17.14 80.65,17.14 83.82,13.97 89.54,13.97 91.44,12.06 v95.25,12.06 | v40.01,16.51 35.56,16.51 v33.66,18.41 32.39,19.68 25.4,19.68 v23.5,21.59 | v66.68,5.08 66.04,4.45 40.64,4.45 v40.01,5.08
E2  (via drill 0.61)
  Top 0.254: 85.09,10.16 v83.82,10.16 E13.2 | 85.09,10.16 86.36,11.43 E16.12 | E19.10 100.97,13.97 100.97,16.51 102.24,17.78 109.86,17.78 109.86,5.71 105.41,1.27 85.09,1.27 85.09,10.16 | E4.12 35.56,11.43 v35.56,12.7 | v55.88,12.7 E7.4 | v68.58,10.16 E10.2 | v22.86,15.24 E1.9
  Bottom 0.254: 22.86,16.51 8.26,16.51 U$1.E2 | 22.86,16.51 31.75,16.51 v35.56,12.7 v55.88,12.7 56.52,12.06 66.68,12.06 v68.58,10.16 69.22,9.53 83.19,9.53 v83.82,10.16 | 22.86,16.51 v22.86,15.24
F1  (via drill 0.61)
  Top 0.254: E1.11 26.04,12.7 26.67,13.34 26.67,17.14 24.77,19.05 | v23.5,19.05 24.77,19.05 | v15.88,19.68 8.26,19.68 U$1.F1 | E7.9 49.53,15.24 | 49.53,15.24 E4.6 | E11.13 63.5,26.67 62.23,25.4 62.23,20.95 | v62.23,19.68 62.23,20.95 | v51.44,18.41 49.53,16.51 49.53,15.24 | E14.12 74.93,27.94 73.66,26.67 v73.66,21.59 | 62.23,20.95 v64.14,20.95 | 91.44,15.24 E16.6 | v91.44,20.32 91.44,15.24 | v96.52,10.16 E19.13 | 91.44,15.24 v91.44,14.61 | 24.77,19.05 26.04,20.32 v26.04,20.95
  Bottom 0.254: v23.5,19.05 22.86,19.68 v15.88,19.68 | v62.23,19.68 60.96,18.41 v51.44,18.41 49.53,20.32 26.67,20.32 v26.04,20.95 | 73.03,20.95 v73.66,21.59 | v64.14,20.95 73.03,20.95 | v91.44,20.32 90.81,20.95 73.03,20.95 | v96.52,10.16 96.52,13.34 92.71,13.34 v91.44,14.61
F2  (via drill 0.61)
  Top 0.254: E13.3 v83.82,11.43 85.09,11.43 85.09,12.7 86.36,13.97 E16.10 88.27,13.97 90.17,15.88 v90.17,19.68 | v102.24,16.51 E19.7 | v23.5,17.78 24.77,16.51 E1.8 | E4.11 36.83,12.7 v35.56,13.97 | v55.88,13.97 E7.5 | v68.58,12.7 E10.4
  Bottom 0.254: v102.24,16.51 99.7,19.05 90.81,19.05 v90.17,19.68 | U$1.F2 8.26,19.68 14.61,19.68 15.88,18.41 22.86,18.41 v23.5,17.78 24.13,17.14 32.39,17.14 v35.56,13.97 v55.88,13.97 57.15,12.7 v68.58,12.7 71.76,12.7 73.03,11.43 73.66,11.43 74.3,12.06 83.19,12.06 v83.82,11.43
FF1  (via drill 0.61)
  Top 0.254: E16.13 88.9,10.16 v88.9,3.81 | v106.68,15.24 E19.6
  Bottom 0.254: v88.9,3.81 89.54,4.45 104.14,4.45 109.86,10.16 109.86,15.24 | 109.86,55.24 109.86,15.24 | 109.86,55.24 98.43,55.24 FF1.1 | 109.86,15.24 v106.68,15.24 | J1.2 97.16,59.05 106.05,59.05 109.86,55.24
FF2  (via drill 0.61)
  Top 0.254: v94.62,24.13 93.35,25.4 E17.1 | v102.87,26.67 E20.2
  Bottom 0.254: v94.62,24.13 95.25,24.77 99.06,24.77 99.06,32.38 102.24,32.38 | 102.24,32.38 109.22,39.37 109.22,50.8 101.6,50.8 100.97,51.44 | 100.97,51.44 97.79,54.61 J2.2 | v102.87,26.67 102.87,32.38 102.24,32.38 | FF2.1 97.16,51.44 100.97,51.44
GND  (via drill 0.61)
  Top 0.381: R3.1 72.39,51.44 v71.76,50.8 70.49,49.53 E12.7 | R1.1 76.84,57.15 79.38,54.61 79.38,51.44 81.28,49.53 E15.7 | v33.02,49.53 E3.7 | E6.7 v41.91,49.53 | v55.88,49.53 E9.7 | U$1.T1 8.26,52.07 17.78,52.07 v17.78,51.44 v17.78,40.64 | C8.2 57.15,16.51 E7.7 | C2.2 30.48,16.51 E1.7 | C5.2 43.18,16.51 E4.7 | 69.85,19.68 C11.2 72.39,25.4 72.39,31.75 69.85,34.29 | 69.85,19.68 69.85,16.51 E10.7 | 69.85,19.68 78.11,19.68 81.28,16.51 E13.7 | v100.33,29.21 E20.11 | C17.2 92.71,17.78 | 92.71,17.78 92.71,16.51 E16.7 | 92.71,17.78 95.25,15.24 95.25,13.97 96.52,12.7 E19.11 99.7,12.7 v100.33,12.06 | C9.2 57.15,33.02 E8.7 | C3.2 30.48,33.02 E2.7 | C6.2 43.18,33.02 E5.7 | C12.2 69.85,34.29 | 69.85,34.29 69.85,33.02 E11.7 | C15.2 81.28,33.02 E14.7 | C18.2 92.71,33.02 E17.7 | E21.11 100.33,45.72 100.33,40.64 C21.2 | v92.71,50.8 92.71,49.53 E18.7
  Bottom 0.381: U$1.C2 8.26,10.16 26.67,10.16 C1.2 34.93,6.35 35.56,6.99 36.83,6.99 37.47,7.62 40.64,7.62 41.91,6.35 C4.2 44.45,7.62 55.88,7.62 | C7.2 55.88,7.62 | 55.88,7.62 65.41,7.62 66.04,6.99 69.22,6.99 C10.2 72.39,6.35 73.66,7.62 80.01,7.62 C13.2 82.55,7.62 91.44,7.62 C16.2 C19.2 99.06,12.06 v100.33,12.06 | R1.1 R3.1 | v71.76,50.8 71.12,50.16 64.77,50.16 64.14,49.53 v55.88,49.53 v41.91,49.53 v33.02,49.53 17.78,49.53 v17.78,51.44 | C2.2 31.75,24.13 41.91,24.13 | C5.2 41.91,24.13 | 41.91,24.13 52.71,24.13 53.34,23.5 56.52,23.5 C8.2 62.87,22.86 64.14,24.13 66.68,24.13 67.95,22.86 C11.2 71.12,24.13 78.11,24.13 79.38,22.86 C14.2 81.92,23.5 86.36,23.5 87,24.13 91.44,24.13 C17.2 C20.2 100.33,22.86 v100.33,29.21 | 31.75,40.64 C3.2 | 31.75,40.64 41.91,40.64 C6.2 49.53,39.37 50.8,38.1 55.88,38.1 C9.2 60.96,39.37 61.6,38.73 63.5,38.73 64.14,38.1 71.12,38.1 | 71.12,38.1 C12.2 | 71.12,38.1 80.01,38.1 C15.2 85.73,39.37 87,40.64 91.44,40.64 C18.2 C21.2 99.06,47.62 97.16,49.53 93.98,49.53 v92.71,50.8 | 31.75,40.64 v17.78,40.64
  pour Top: 16.51,0 16.51,62.23 125.73,62.23 125.73,0
  pour Bottom: 16.51,0 16.51,62.23 125.73,62.23 125.73,0
H1  (via drill 0.61)
  Top 0.254: E20.1 103.51,25.4 102.24,24.13 97.79,24.13 93.98,27.94 E17.3 88.9,27.94 88.9,22.23 v86.36,19.68 | 22.86,13.97 21.59,13.97 21.59,18.41 24.77,21.59 v23.5,22.86 8.26,22.86 U$1.H1 | 22.86,13.97 E1.10 | E7.11 47.63,12.7 47.63,2.54 46.36,1.27 | 46.36,1.27 22.86,1.27 22.86,13.97 | E11.12 62.87,27.94 62.87,27.3 v62.23,26.67 60.96,25.4 60.96,15.24 | 60.96,15.24 60.96,6.99 55.25,1.27 46.36,1.27 | E5.4 41.91,29.21 v41.91,25.4 | E14.11 73.66,29.21 v73.66,27.94 | 60.96,15.24 v65.41,19.68
  Bottom 0.254: v41.91,25.4 41.28,24.77 25.4,24.77 v23.5,22.86 | v73.66,27.94 63.5,27.94 v62.23,26.67 | v65.41,19.68 v86.36,19.68
H2  (via drill 0.61)
  Top 0.254: E19.9 96.52,15.24 v96.52,14.61 | v88.9,15.88 88.27,15.24 E16.9 86.36,15.24 84.46,13.34 84.46,12.7 E13.4 78.74,12.7 v78.74,14.61 | E1.13 27.94,10.16 27.94,17.78 v28.58,18.41 | E4.10 36.83,13.97 v35.56,15.24 | v55.88,15.24 E7.6 | E10.5 68.58,13.97 v68.58,15.24
  Bottom 0.254: v96.52,14.61 95.89,15.24 92.08,15.24 91.44,15.88 v88.9,15.88 | U$1.H2 8.26,22.86 20.96,22.86 24.77,19.05 27.94,19.05 v28.58,18.41 32.39,18.41 v35.56,15.24 v55.88,15.24 v68.58,15.24 78.11,15.24 v78.74,14.61
J1  (via drill 0.61)
  Top 0.254: E20.3 105.41,27.94 106.68,26.67 106.68,25.4 105.41,24.13 103.51,24.13 102.87,23.5 102.87,21.59 98.43,21.59 96.52,23.5 96.52,24.13 93.98,26.67 E17.2 92.08,26.67 91.44,26.04 91.44,23.5 88.27,20.32 88.27,18.41 83.82,18.41 78.74,23.5 78.74,24.13 | E14.5 80.65,30.48 80.01,31.11 78.74,31.11 78.74,24.13 | E11.10 63.5,30.48 62.23,29.21 62.23,27.94 60.33,26.04 60.33,24.13 v58.42,24.13 56.52,24.13 55.88,23.5 55.88,20.32 52.07,16.51 E7.8 | E2.1 29.21,25.4 v29.21,26.04 | E5.5 45.09,30.48 45.09,29.84 45.72,29.21 v45.72,26.67 | v15.88,26.67 8.26,26.67 U$1.J1 | v80.01,24.13 78.74,24.13
  Bottom 0.254: v15.88,26.67 16.51,27.3 27.94,27.3 v29.21,26.04 29.85,25.4 40.64,25.4 41.91,26.67 v45.72,26.67 47.63,24.77 54.61,24.77 55.25,24.13 v58.42,24.13 59.06,24.77 67.31,24.77 67.95,24.13 68.58,24.13 69.22,24.77 79.38,24.77 v80.01,24.13
J2  (via drill 0.61)
  Top 0.254: E10.6 73.66,15.24 74.93,16.51 75.57,16.51 | E1.12 27.31,11.43 27.31,12.06 | 27.31,12.06 v27.31,21.59 27.31,25.4 v26.67,26.04 | E4.9 39.37,15.24 v39.37,11.43 | 27.31,12.06 v26.67,12.06 | E8.3 56.52,27.94 53.34,24.77 v53.34,20.32 | v85.09,16.51 E16.8 | v97.16,17.78 98.43,16.51 E19.8 | v75.57,18.41 75.57,16.51 | 75.57,16.51 E13.8
  Bottom 0.254: v26.67,26.04 26.04,25.4 15.24,25.4 14.61,26.04 8.26,26.04 U$1.J2 | v39.37,11.43 27.31,11.43 v26.67,12.06 | 52.71,20.95 v53.34,20.32 | 52.71,20.95 27.94,20.95 v27.31,21.59 | 83.19,18.41 v85.09,16.51 | 83.19,18.41 v75.57,18.41 65.41,18.41 62.87,20.95 52.71,20.95 | v97.16,17.78 96.52,18.41 83.19,18.41
K1  (via drill 0.61)
  Top 0.254: E20.14 97.79,25.4 93.98,29.21 E17.4 90.17,29.21 90.17,32.38 v87.63,34.92 | E2.2 33.02,26.67 v33.02,27.3 | v55.88,26.04 56.52,25.4 E8.1 58.42,25.4 60.96,27.94 60.96,29.21 62.87,31.11 62.87,31.75 E11.9 65.41,31.75 v66.68,33.02 | E5.6 45.72,31.75 45.72,30.48 46.99,29.21 v46.99,27.3 | E14.6 80.01,31.75 v80.01,33.66 | v15.24,27.94 15.24,29.21 8.26,29.21 U$1.K1
  Bottom 0.254: v33.02,27.3 33.66,27.94 35.56,27.94 | 46.99,27.94 52.71,27.94 54.61,26.04 v55.88,26.04 | 46.99,27.94 35.56,27.94 | 46.99,27.94 v46.99,27.3 | 78.11,35.56 v80.01,33.66 | 78.11,35.56 69.22,35.56 v66.68,33.02 | v87.63,34.92 87,35.56 78.11,35.56 | v15.24,27.94 28.58,27.94 29.21,27.3 30.48,27.3 33.02,29.84 33.66,29.84 35.56,27.94
K2  (via drill 0.61)
  Top 0.254: 29.85,27.94 27.94,26.04 27.94,24.13 31.12,24.13 36.83,18.41 36.83,17.14 37.47,16.51 E4.8 38.1,16.51 41.91,20.32 41.91,23.5 42.55,24.13 47.63,24.13 v47.63,26.04 | E2.3 29.85,27.94 | v29.21,28.57 29.85,27.94 | K2A.1 85.09,53.34 85.09,55.88 K2B.1 | E20.6 102.24,31.75 v102.24,35.56 102.24,41.91 102.87,42.55 | 102.87,42.55 103.51,43.18 E21.2 | E21.6 v102.87,48.26 102.87,42.55 | E18.13 88.27,43.18 88.9,42.55 88.9,41.91 E18.1 93.35,41.91 94.62,40.64 v94.62,36.2 | v68.58,25.4 E11.1 | v80.01,25.4 E14.1 81.92,25.4 82.55,24.77 82.55,23.5 84.46,23.5 85.73,24.77 85.09,25.4 85.09,26.67 E17.13 | E8.4 55.88,29.21 v55.88,28.57
  Bottom 0.254: v29.21,28.57 28.58,29.21 8.26,29.21 U$1.K2 | K2A.1 87,52.7 93.98,52.7 95.89,50.8 100.33,50.8 v102.87,48.26 | 58.42,26.04 59.06,25.4 v68.58,25.4 v80.01,25.4 80.65,26.04 97.79,26.04 97.79,33.02 95.25,35.56 | 58.42,26.04 v55.88,28.57 | 95.25,35.56 v94.62,36.2 | 95.25,35.56 v102.24,35.56 | v47.63,26.04 48.26,25.4 55.25,25.4 55.88,24.77 57.15,24.77 58.42,26.04
L1  (via drill 0.61)
  Top 0.254: 42.55,36.83 42.55,38.1 41.91,38.73 41.91,40.64 43.18,41.91 E6.1 | 42.55,36.83 42.55,34.29 40.64,32.38 40.64,21.59 37.47,21.59 34.93,24.13 34.93,27.94 33.66,29.21 33.66,30.48 E2.5 29.85,30.48 v29.21,29.84 | 95.25,30.48 96.52,30.48 96.52,29.21 97.79,27.94 E20.12 | 95.25,30.48 E17.5 | E8.2 58.42,26.67 60.33,28.57 60.33,29.84 62.23,31.75 62.23,32.38 62.87,33.02 E11.8 64.77,33.02 64.77,33.66 v67.31,36.2 67.31,40.64 70.49,40.64 71.12,40.01 71.12,34.92 v73.66,32.38 | v95.25,31.11 95.25,30.48 | v41.91,36.83 42.55,36.83 | v15.88,31.75 15.88,32.38 8.26,32.38 U$1.L1
  Bottom 0.254: v95.25,31.11 93.98,32.38 v73.66,32.38 | v41.91,36.83 42.55,36.2 v67.31,36.2 | v15.88,31.75 17.78,29.84 v29.21,29.84
L2  (via drill 0.61)
  Top 0.254: E2.4 33.02,29.21 v33.02,28.57 | v39.37,26.67 39.37,29.84 38.74,30.48 | E5.10 38.74,30.48 | E8.5 55.88,30.48 v55.88,31.11 v55.88,34.29 | 38.74,30.48 v39.37,31.11 | E11.2 v68.58,26.67 67.31,27.94 67.31,31.75 67.95,32.38 67.95,33.02 v66.68,34.29 | E14.2 v80.01,26.67 | v88.9,29.21 E17.11 86.36,29.21 85.73,28.57 85.09,28.57 83.82,29.84 83.82,33.02 83.19,33.66 83.19,40.01 v82.55,40.64 | E20.5 101.6,30.48 101.6,34.92 v95.89,40.64 | v18.42,33.66 19.05,34.29 v19.05,50.8 | v44.45,53.98 47.63,50.8 v47.63,31.75
  Bottom 0.254: v33.02,28.57 31.75,27.3 31.75,26.04 38.74,26.04 v39.37,26.67 | v39.37,31.11 47.63,31.11 | 47.63,31.11 v55.88,31.11 | v68.58,26.67 v80.01,26.67 86.36,26.67 v88.9,29.21 | v95.89,40.64 95.25,41.27 83.19,41.27 v82.55,40.64 | v66.68,34.29 v55.88,34.29 | v18.42,33.66 17.78,33.02 8.26,33.02 U$1.L2 | v19.05,50.8 22.23,53.98 v44.45,53.98 | 47.63,31.11 v47.63,31.75
M1  (via drill 0.61)
  Top 0.254: E20.13 99.7,26.67 101.6,28.57 101.6,29.21 100.97,29.84 100.97,34.29 99.7,35.56 97.79,35.56 94.62,32.38 94.62,31.75 E17.6 90.81,31.75 90.81,34.29 86.36,38.73 86.36,40.64 85.09,41.91 v85.09,42.55 | E8.13 53.98,26.67 53.98,27.94 54.61,28.57 v54.61,34.92 54.61,38.73 56.52,40.64 58.42,40.64 58.42,38.73 57.79,38.1 59.06,36.83 61.6,36.83 61.6,41.27 63.5,43.18 E12.13 65.41,43.18 66.04,42.55 66.04,41.91 v66.68,41.27 | E2.6 29.21,31.75 v29.21,36.83 | E6.2 40.64,43.18 v40.64,39.37 | E15.12 74.3,44.45 74.3,43.81 73.66,43.18 v73.66,41.27 | v17.15,38.1 17.15,36.2 8.26,36.2 U$1.M1
  Bottom 0.254: 40.64,35.56 53.98,35.56 v54.61,34.92 | 40.64,35.56 38.1,35.56 37.47,36.2 29.85,36.2 v29.21,36.83 28.58,37.47 17.78,37.47 v17.15,38.1 | 40.64,35.56 v40.64,39.37 | v66.68,41.27 v73.66,41.27 74.3,40.64 79.38,40.64 80.65,41.91 84.46,41.91 v85.09,42.55
M2  (via drill 0.61)
  Top 0.254: E17.12 84.46,27.94 | 84.46,27.94 v83.82,27.94 E14.3 | v68.58,29.21 E11.4 | 59.69,31.75 E8.6 | v59.69,30.48 59.69,31.75 | E20.10 100.33,30.48 100.33,33.66 v99.7,34.29 | 84.46,27.94 v84.46,24.77 | v22.86,31.75 E2.9 | v35.56,30.48 35.56,31.75 E5.9 38.74,31.75 v41.28,34.29 | v60.96,33.02 59.69,31.75
  Bottom 0.254: v83.82,27.94 80.65,27.94 79.38,29.21 v68.58,29.21 60.96,29.21 v59.69,30.48 | v99.7,34.29 98.43,33.02 98.43,25.4 85.09,25.4 v84.46,24.77 | U$1.M2 8.26,35.56 14.61,35.56 15.24,34.92 19.69,34.92 v22.86,31.75 23.5,31.11 34.93,31.11 v35.56,30.48 | v60.96,33.02 53.98,33.02 52.71,34.29 v41.28,34.29
N1  (via drill 0.61)
  Top 0.254: v31.75,34.29 31.75,41.27 31.12,41.91 E3.1 | v53.34,28.57 52.71,27.94 E8.12 50.17,27.94 46.36,31.75 v46.36,42.55 45.09,43.81 45.09,44.45 E6.3 | E12.12 62.23,44.45 v62.23,43.81 | v73.03,43.81 73.03,45.72 E15.11 76.84,45.72 78.11,46.99 78.11,53.34 v77.47,53.98 | E21.1 109.22,41.91 109.22,48.26 v100.97,56.52 | E18.3 91.44,44.45 v91.44,45.09 | v15.24,37.47 15.24,38.73 8.26,38.73 U$1.N1
  Bottom 0.254: v53.34,28.57 39.37,28.57 36.2,31.75 34.29,31.75 v31.75,34.29 24.77,34.29 23.5,35.56 17.15,35.56 v15.24,37.47 | v46.36,42.55 45.09,42.55 45.09,43.81 46.36,45.09 54.61,45.09 55.88,43.81 v62.23,43.81 v73.03,43.81 73.66,43.18 84.46,43.18 86.36,45.09 v91.44,45.09 | v100.97,56.52 99.06,58.42 94.62,58.42 92.08,55.88 79.38,55.88 v77.47,53.98
N2  (via drill 0.61)
  Top 0.254: v24.77,35.56 24.77,33.02 E2.8 | v36.2,34.29 37.47,33.02 E5.8 | E8.11 50.17,29.21 v49.53,29.84 | v68.58,30.48 E11.5 | E14.4 80.01,29.21 v80.01,29.84 | 85.09,30.48 E17.10 | v85.09,29.84 85.09,30.48 | v103.51,34.92 103.51,33.66 104.14,33.02 E20.7 | v84.46,36.83 84.46,31.11 85.09,30.48
  Bottom 0.254: U$1.N2 8.26,38.73 15.24,38.73 17.15,36.83 23.5,36.83 v24.77,35.56 33.66,35.56 | v36.2,34.29 34.93,35.56 33.66,35.56 | 33.66,35.56 39.37,29.84 v49.53,29.84 55.88,29.84 57.79,31.75 59.69,31.75 60.33,31.11 67.95,31.11 v68.58,30.48 79.38,30.48 v80.01,29.84 v85.09,29.84 | v103.51,34.92 103.51,37.47 85.09,37.47 v84.46,36.83
P1  (via drill 0.61)
  Top 0.254: E9.1 59.69,41.91 59.69,43.18 v61.6,45.09 63.5,46.99 E12.10 | 29.21,43.18 E3.2 | v29.21,44.45 29.21,43.18 | E18.2 90.81,43.18 90.81,44.45 90.17,45.09 v90.17,47.62 v90.17,50.8 | v107.95,44.45 E21.3 | E6.4 41.91,45.72 v41.91,45.09 | v80.01,46.99 E15.5 | 29.21,43.18 28.58,42.55 28.58,37.47 25.4,37.47 22.23,34.29 22.23,32.38 18.42,32.38 17.15,33.66 18.42,34.92 18.42,38.1 15.24,41.27 15.24,41.91 8.26,41.91 U$1.P1
  Bottom 0.254: 41.91,44.45 44.45,44.45 45.72,45.72 55.25,45.72 55.88,45.09 v61.6,45.09 67.31,45.09 69.85,47.62 72.39,47.62 73.03,46.99 73.66,46.99 75.57,48.9 80.01,48.9 | 41.91,44.45 v29.21,44.45 | v90.17,47.62 89.54,48.26 84.46,48.26 83.82,48.9 80.01,48.9 | v107.95,44.45 107.95,46.99 100.97,46.99 97.79,50.16 94.62,50.16 92.71,52.07 91.44,52.07 v90.17,50.8 | 41.91,44.45 v41.91,45.09 | 80.01,48.9 v80.01,46.99
P2  (via drill 0.61)
  Top 0.254: E6.13 v35.56,43.18 33.02,43.18 31.75,44.45 E3.3 | E8.10 53.34,30.48 v53.34,32.38 v53.34,40.64 | v68.58,31.75 E11.6 | v74.3,34.29 75.57,33.02 E14.8 | E17.9 88.9,31.75 v88.9,31.11 | v96.52,31.75 E20.9
  Bottom 0.254: v53.34,40.64 52.71,41.27 41.28,41.27 39.37,43.18 v35.56,43.18 24.13,43.18 23.5,42.55 8.26,42.55 U$1.P2 | v53.34,32.38 60.33,32.38 60.96,31.75 v68.58,31.75 71.76,31.75 72.39,32.38 | 72.39,32.38 v74.3,34.29 | 72.39,32.38 73.66,31.11 v88.9,31.11 90.17,29.84 96.52,29.84 v96.52,31.75
R1  (via drill 0.61)
  Top 0.254: E21.14 95.25,41.91 v95.25,43.81 95.25,44.45 93.98,45.72 E18.4 | E9.2 58.42,43.18 62.23,46.99 | 62.23,46.99 63.5,48.26 E12.9 | 62.23,46.99 62.23,49.53 v63.5,50.8 63.5,55.88 76.84,55.88 78.74,53.98 78.74,48.26 E15.6 82.55,48.26 83.19,47.62 v83.82,47.62 | E3.5 33.02,46.99 v33.02,45.72 | v40.64,45.72 41.91,46.99 E6.5 44.45,46.99 45.72,48.26 45.72,50.16 v45.09,50.8 | v15.88,43.81 14.61,45.09 8.26,45.09 U$1.R1
  Bottom 0.254: v95.25,43.81 92.71,46.35 90.17,46.35 88.9,47.62 v83.82,47.62 | v40.64,45.72 40.01,45.09 33.66,45.09 v33.02,45.72 25.4,45.72 22.86,43.18 16.51,43.18 v15.88,43.81 | v45.09,50.8 v63.5,50.8
R2  (via drill 0.61)
  Top 0.254: E17.8 87,33.02 v85.73,34.29 85.73,38.73 82.55,41.91 E15.1 81.28,41.91 80.01,40.64 80.01,35.56 76.84,35.56 70.49,41.91 E12.1 67.31,41.91 v67.31,53.98 | v96.52,33.02 E20.8 | E3.4 31.75,45.72 33.02,44.45 E6.12 38.74,44.45 39.37,43.81 v39.37,41.91 39.37,34.92 v40.01,34.29 | E8.9 49.53,31.75 v49.53,32.38 | 16.51,44.45 17.15,43.81 17.15,41.91 v16.51,41.27 | 16.51,44.45 v15.88,45.09 | 16.51,44.45 v16.51,50.8
  Bottom 0.254: v96.52,33.02 95.89,33.66 86.36,33.66 v85.73,34.29 | v49.53,32.38 48.9,33.02 41.28,33.02 v40.01,34.29 | v15.88,45.09 8.26,45.09 U$1.R2 | v16.51,41.27 17.15,41.91 v39.37,41.91 | v67.31,53.98 65.41,55.88 21.59,55.88 18.42,52.7 17.78,52.7 16.51,51.44 v16.51,50.8
S1  (via drill 0.61)
  Top 0.254: E18.5 v95.25,46.99 97.79,44.45 E21.12 | 29.21,48.26 E3.6 | v29.21,50.8 29.21,48.26 | v40.64,50.8 40.64,49.53 v41.91,48.26 E6.6 | E9.13 50.8,43.18 49.53,44.45 v49.53,47.62 | E12.8 66.04,49.53 v66.04,48.9 | v15.24,46.99 15.24,48.26 8.26,48.26 U$1.S1 | v21.59,44.45 22.86,43.18 22.86,40.01 24.77,38.1 26.67,38.1 26.67,45.09 29.21,47.62 29.21,48.26
  Bottom 0.254: v40.64,50.8 v29.21,50.8 | 48.9,48.26 v49.53,47.62 | v41.91,48.26 48.9,48.26 | 48.9,48.26 65.41,48.26 v66.04,48.9 66.68,49.53 84.46,49.53 85.09,48.9 91.44,48.9 92.08,48.26 93.98,48.26 v95.25,46.99 | v15.24,46.99 17.78,44.45 v21.59,44.45
S2  (via drill 0.61)
  Top 0.254: E3.13 23.5,43.18 23.5,43.81 v22.86,44.45 | E6.11 39.37,45.72 v39.37,46.35 40.64,47.62 40.64,48.26 39.37,49.53 39.37,56.52 v38.74,57.15 | v49.53,37.47 49.53,34.92 51.44,33.02 E8.8 | v59.06,38.1 60.96,40.01 v60.96,42.55 | v72.39,42.55 71.76,42.55 71.12,43.18 E12.2 | 83.82,43.18 84.46,43.18 84.46,43.81 86.36,45.72 E18.11 | 83.82,43.18 E15.2 80.65,43.18 v79.38,41.91 | E21.5 106.68,46.99 106.68,49.53 97.79,58.42 88.27,58.42 88.27,59.69 87,60.96 83.82,60.96 v83.82,58.42 83.82,48.9 85.09,47.62 83.82,46.35 83.82,43.18
  Bottom 0.254: 20.32,46.99 19.05,48.26 8.26,48.26 U$1.S2 | 20.32,46.99 v22.86,44.45 | v39.37,46.35 38.1,47.62 27.31,47.62 26.67,46.99 20.32,46.99 | v49.53,37.47 58.42,37.47 v59.06,38.1 | v60.96,42.55 v72.39,42.55 78.74,42.55 v79.38,41.91 | v38.74,57.15 40.01,58.42 v83.82,58.42
T2  (via drill 0.61)
  Top 0.254: E12.4 68.58,45.72 v68.58,45.09 | E15.3 v80.01,44.45 77.47,41.91 v77.47,36.83 | 88.9,44.45 E18.12 | v88.9,46.35 88.9,44.45 | v96.52,46.99 E21.10 | 88.9,44.45 v89.54,43.81 | E3.12 24.13,44.45 v22.86,45.72 21.59,46.99 v21.59,48.26 | 35.56,46.99 E6.10 | v35.56,46.35 35.56,46.99 | E9.3 55.25,44.45 v55.25,43.18 | v46.36,43.81 46.36,50.8 38.74,58.42 35.56,58.42 35.56,46.99 | v62.87,40.64 v62.87,37.47
  Bottom 0.254: v68.58,45.09 79.38,45.09 v80.01,44.45 84.46,44.45 85.73,45.72 88.27,45.72 v88.9,46.35 | v96.52,46.99 96.52,45.09 97.79,43.81 97.79,42.55 90.81,42.55 v89.54,43.81 | v21.59,48.26 20.96,48.9 17.15,48.9 14.61,51.44 8.26,51.44 U$1.T2 | v35.56,46.35 34.93,46.99 27.94,46.99 27.31,46.35 23.5,46.35 v22.86,45.72 | v46.36,43.81 54.61,43.81 v55.25,43.18 57.15,41.27 62.23,41.27 v62.87,40.64 | v77.47,36.83 76.84,37.47 v62.87,37.47
U1  (via drill 0.61)
  Top 0.254: E3.10 22.86,46.99 22.86,48.26 20.96,50.16 20.96,52.07 | 20.96,52.07 20.96,52.7 19.05,54.61 8.26,54.61 U$1.U1 | E21.13 97.16,43.18 v96.52,43.81 | 92.08,48.26 v91.44,47.62 | E18.6 92.08,48.26 | E9.12 54.61,44.45 54.61,50.8 R2.1 | 92.08,48.26 91.44,48.9 91.44,50.8 92.08,51.44 v92.08,57.15 | v88.9,60.33 87.63,61.59 62.23,61.59 62.23,59.05 | R1.2 62.23,59.05 | v21.59,52.07 20.96,52.07 | v27.31,52.7 33.66,59.05 62.23,59.05
  Bottom 0.254: v96.52,43.81 92.71,47.62 v91.44,47.62 | R2.1 R1.2 | v88.9,60.33 v92.08,57.15 | v21.59,52.07 22.23,52.7 v27.31,52.7
U2  (via drill 0.61)
  Top 0.254: v80.01,45.72 E15.4 | v85.09,46.35 85.73,46.35 86.36,46.99 E18.10 88.27,46.99 88.9,47.62 88.9,52.7 v90.81,54.61 | 72.39,46.99 E12.5 | v72.39,46.35 72.39,46.99 | v95.25,55.88 97.79,55.88 104.14,49.53 E21.7 | v55.88,46.35 55.88,45.72 E9.4 59.69,45.72 61.6,47.62 61.6,51.44 v62.23,52.07 | E6.9 v39.37,48.26 | v26.67,48.26 E3.9 24.13,48.26 22.86,49.53 22.86,52.07 v19.69,55.24 | 72.39,46.99 72.39,49.53 v73.66,50.8
  Bottom 0.254: v85.09,46.35 80.65,46.35 v80.01,45.72 73.03,45.72 v72.39,46.35 | v95.25,55.88 93.98,54.61 v90.81,54.61 | v55.88,46.35 41.28,46.35 v39.37,48.26 v26.67,48.26 | v19.69,55.24 8.26,55.24 U$1.U2 | v73.66,50.8 72.39,52.07 v62.23,52.07
V1  (via drill 0.61)
  Top 0.254: E3.11 26.04,45.72 27.94,47.62 27.94,49.53 v26.67,50.8 19.69,57.78 8.26,57.78 U$1.V1 | E9.6 60.96,48.26 R4.1 | v87.63,50.8 87.63,49.53 E18.8 | v98.43,52.7 98.43,49.53 E21.8
  Bottom 0.254: v87.63,50.8 85.73,50.8 84.46,52.07 | 84.46,52.07 83.82,52.7 64.14,52.7 R3.2 R4.1 59.06,52.7 28.58,52.7 v26.67,50.8 | v98.43,52.7 97.79,53.34 85.73,53.34 84.46,52.07
V2  (via drill 0.61)
  Top 0.254: v59.69,46.99 E9.5 | v68.58,47.62 69.22,48.26 E12.6 | v19.69,56.52 23.5,52.7 23.5,50.8 24.77,49.53 E3.8 | v36.83,57.15 36.83,50.16 37.47,49.53 E6.8 | E18.9 85.73,48.26 85.73,48.9 84.46,50.16 | 84.46,50.16 84.46,57.78 v85.09,58.42 | v96.52,48.26 E21.9 | 84.46,50.16 v85.09,50.16 | v76.84,50.8 76.84,50.16 76.2,49.53 E15.8 74.93,49.53 v73.66,48.26
  Bottom 0.254: v59.69,46.99 60.33,47.62 v68.58,47.62 69.22,48.26 v73.66,48.26 | U$1.V2 8.26,57.78 18.42,57.78 v19.69,56.52 36.2,56.52 v36.83,57.15 39.37,59.69 83.82,59.69 v85.09,58.42 | v96.52,48.26 95.89,48.9 92.71,48.9 92.08,49.53 85.73,49.53 v85.09,50.16 77.47,50.16 v76.84,50.8
VCC  (via drill 0.61)
  Top 0.381: C1.1 25.4,8.89 E1.14 | C4.1 38.1,8.89 E4.14 | C13.1 76.2,8.89 E13.14 | C16.1 87.63,8.89 E16.14 | C7.1 52.07,8.89 E7.14 | C10.1 64.77,8.89 E10.14 | C3.1 25.4,41.91 E3.14 | E6.14 38.1,41.91 C6.1 34.29,35.56 34.29,29.84 35.56,28.57 35.56,26.67 38.1,24.13 | C8.1 52.07,25.4 E8.14 | C2.1 25.4,25.4 E2.14 | C5.1 38.1,24.13 | 38.1,24.13 38.1,25.4 E5.14 | R2.2 R4.2 48.26,52.07 48.26,44.45 52.07,40.64 | C15.1 76.2,41.91 E15.14 | C9.1 52.07,40.64 | 52.07,40.64 52.07,41.91 E9.14 | C12.1 64.77,41.91 E12.14 | C18.1 87.63,41.91 E18.14 | 106.68,29.21 E20.4 | 106.68,29.21 106.68,36.83 C21.1 | v106.68,45.72 E21.4 | C11.1 64.77,25.4 E11.14 | C14.1 76.2,25.4 E14.14 | C17.1 87.63,25.4 E17.14 | v102.87,12.7 E19.4 | 106.68,29.21 107.32,28.57 107.32,24.77 105.41,22.86 C20.1 | v78.74,36.83 v78.74,39.37
  Bottom 0.381: 53.34,5.08 C7.1 | 53.34,5.08 63.5,5.08 C10.1 67.31,6.35 68.58,5.08 74.93,5.08 C13.1 77.47,5.08 86.36,5.08 C16.1 88.9,5.08 101.6,5.08 102.87,6.35 | 53.34,5.08 41.91,5.08 40.64,6.35 C4.1 36.2,6.35 34.93,5.08 26.67,5.08 C1.1 17.78,6.35 15.88,4.45 8.26,4.45 U$1.A2 | C3.1 26.67,38.1 36.83,38.1 C6.1 | C2.1 28.58,22.86 29.85,21.59 36.83,21.59 | C5.1 36.83,21.59 | 36.83,21.59 50.8,21.59 C8.1 53.34,21.59 62.87,21.59 64.14,22.86 C11.1 66.04,21.59 71.76,21.59 73.03,22.86 C14.1 77.47,21.59 88.9,21.59 | C9.1 55.25,39.37 56.52,40.64 60.96,40.64 62.23,39.37 C12.1 66.68,39.37 67.95,40.64 70.49,40.64 71.12,40.01 75.57,40.01 C15.1 v78.74,39.37 | v106.68,45.72 106.68,39.37 C21.1 102.87,38.1 88.9,38.1 88.27,38.73 | 88.27,38.73 C18.1 | 102.87,6.35 v102.87,12.7 104.14,12.7 104.14,21.59 | C19.1 102.87,6.35 | 104.14,21.59 C20.1 | 88.9,21.59 C17.1 | 104.14,21.59 88.9,21.59 | v78.74,36.83 79.38,37.47 83.19,37.47 84.46,38.73 88.27,38.73

### Text on the board
Bottom: VRS | M111/M113/M115/M117/M119/M206/M209
tNames: M113/M117/M119: | M111 | M113 | M115 | M117 | M119 | Fill Only One Row. | M111/M115/M206/M207: Remove Resistors. | M111/M113/M115/M117/M119/M206/M207
tValues: A1 | Add Resistors. | K2 | A1 | K2 | M207 | M206/M216